# EAGLE schematic Keyboard (EAGLE 9.2.0)
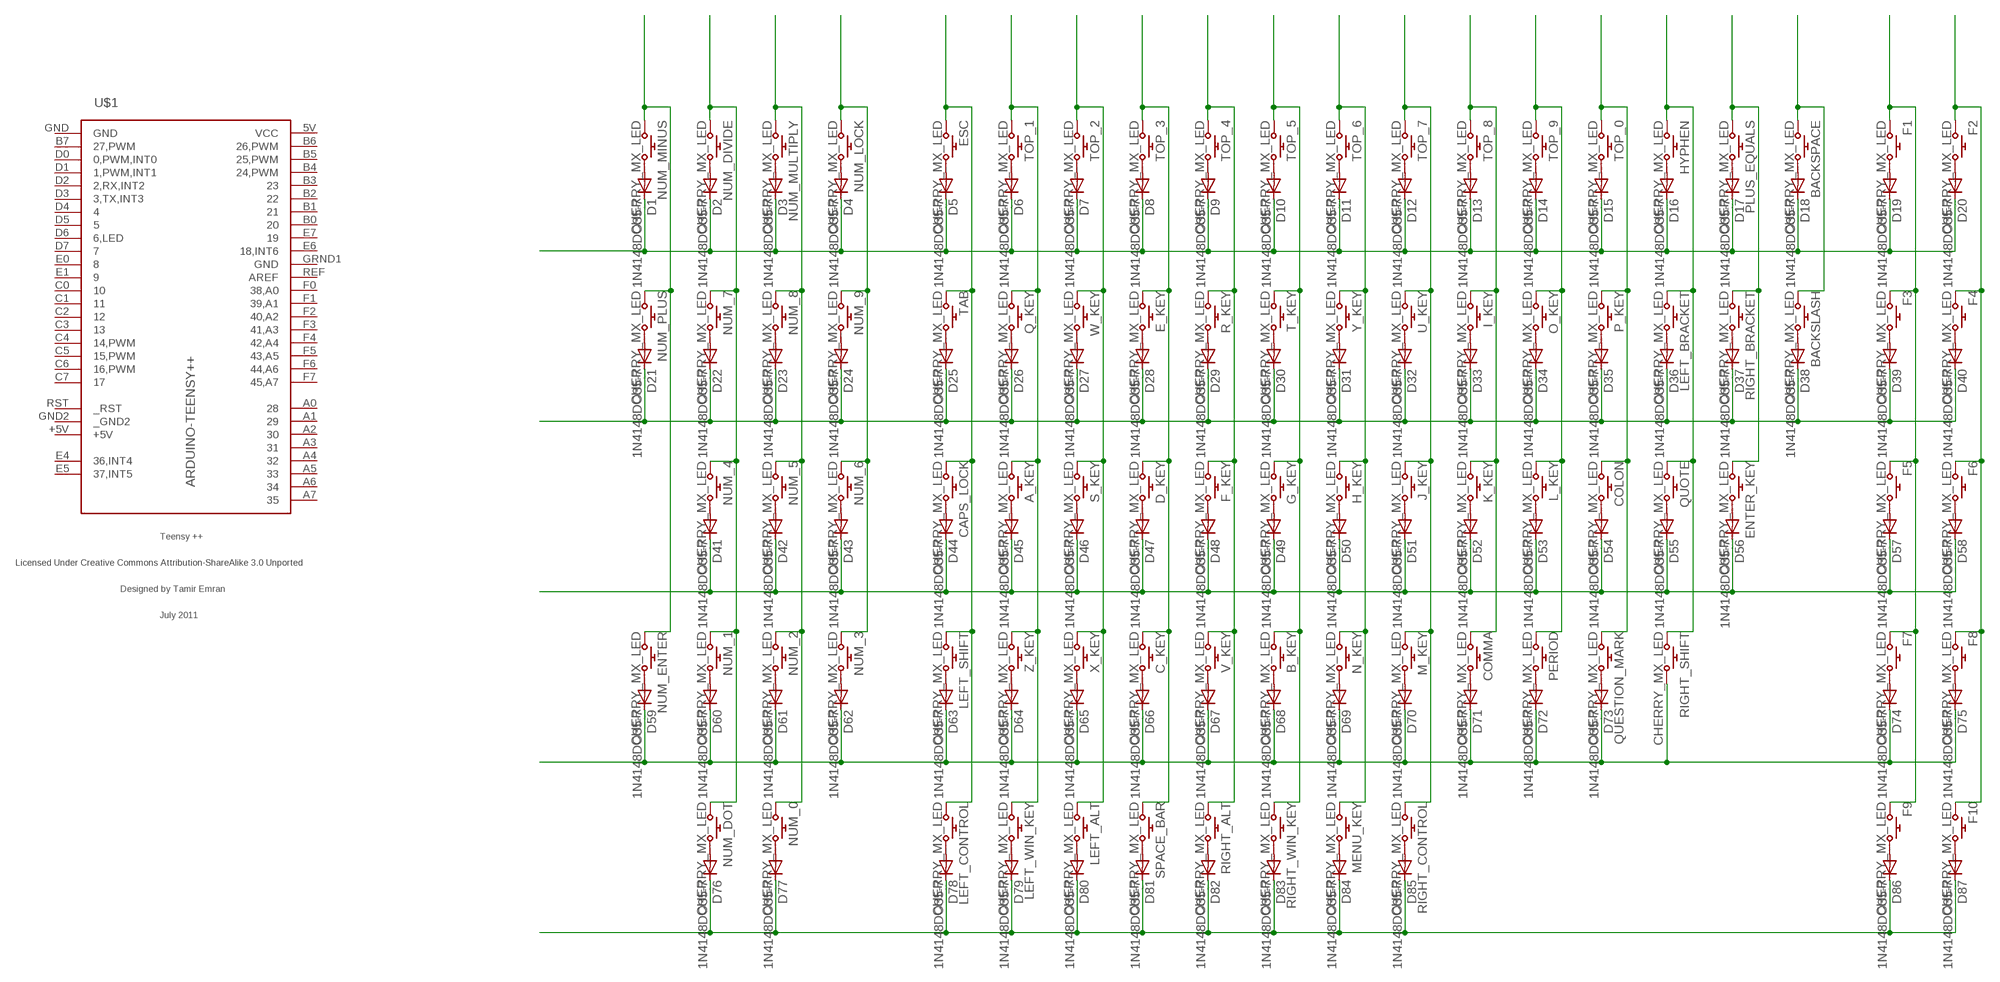
[diagram p0: schematic, sheet 1]

## Parts
A_KEY  CHERRY_MX_LED  [CHERRY_MX_LED]
B_KEY  CHERRY_MX_LED  [CHERRY_MX_LED]
BACKSLASH  CHERRY_MX_LED  [CHERRY_MX_LED]
BACKSPACE  CHERRY_MX_LED  [CHERRY_MX_LED]
C_KEY  CHERRY_MX_LED  [CHERRY_MX_LED]
CAPS_LOCK  CHERRY_MX_LED  [CHERRY_MX_LED]
COLON  CHERRY_MX_LED  [CHERRY_MX_LED]
COMMA  CHERRY_MX_LED  [CHERRY_MX_LED]
D1  1N4148DO35-7  [DO35-7]
D2  1N4148DO35-7  [DO35-7]
D3  1N4148DO35-7  [DO35-7]
D4  1N4148DO35-7  [DO35-7]
D5  1N4148DO35-7  [DO35-7]
D6  1N4148DO35-7  [DO35-7]
D7  1N4148DO35-7  [DO35-7]
D8  1N4148DO35-7  [DO35-7]
D9  1N4148DO35-7  [DO35-7]
D10  1N4148DO35-7  [DO35-7]
D11  1N4148DO35-7  [DO35-7]
D12  1N4148DO35-7  [DO35-7]
D13  1N4148DO35-7  [DO35-7]
D14  1N4148DO35-7  [DO35-7]
D15  1N4148DO35-7  [DO35-7]
D16  1N4148DO35-7  [DO35-7]
D17  1N4148DO35-7  [DO35-7]
D18  1N4148DO35-7  [DO35-7]
D19  1N4148DO35-7  [DO35-7]
D20  1N4148DO35-7  [DO35-7]
D21  1N4148DO35-7  [DO35-7]
D22  1N4148DO35-7  [DO35-7]
D23  1N4148DO35-7  [DO35-7]
D24  1N4148DO35-7  [DO35-7]
D25  1N4148DO35-7  [DO35-7]
D26  1N4148DO35-7  [DO35-7]
D27  1N4148DO35-7  [DO35-7]
D28  1N4148DO35-7  [DO35-7]
D29  1N4148DO35-7  [DO35-7]
D30  1N4148DO35-7  [DO35-7]
D31  1N4148DO35-7  [DO35-7]
D32  1N4148DO35-7  [DO35-7]
D33  1N4148DO35-7  [DO35-7]
D34  1N4148DO35-7  [DO35-7]
D35  1N4148DO35-7  [DO35-7]
D36  1N4148DO35-7  [DO35-7]
D37  1N4148DO35-7  [DO35-7]
D38  1N4148DO35-7  [DO35-7]
D39  1N4148DO35-7  [DO35-7]
D40  1N4148DO35-7  [DO35-7]
D41  1N4148DO35-7  [DO35-7]
D42  1N4148DO35-7  [DO35-7]
D43  1N4148DO35-7  [DO35-7]
D44  1N4148DO35-7  [DO35-7]
D45  1N4148DO35-7  [DO35-7]
D46  1N4148DO35-7  [DO35-7]
D47  1N4148DO35-7  [DO35-7]
D48  1N4148DO35-7  [DO35-7]
D49  1N4148DO35-7  [DO35-7]
D50  1N4148DO35-7  [DO35-7]
D51  1N4148DO35-7  [DO35-7]
D52  1N4148DO35-7  [DO35-7]
D53  1N4148DO35-7  [DO35-7]
D54  1N4148DO35-7  [DO35-7]
D55  1N4148DO35-7  [DO35-7]
D56  1N4148DO35-7  [DO35-7]
D57  1N4148DO35-7  [DO35-7]
D58  1N4148DO35-7  [DO35-7]
D59  1N4148DO35-7  [DO35-7]
D60  1N4148DO35-7  [DO35-7]
D61  1N4148DO35-7  [DO35-7]
D62  1N4148DO35-7  [DO35-7]
D63  1N4148DO35-7  [DO35-7]
D64  1N4148DO35-7  [DO35-7]
D65  1N4148DO35-7  [DO35-7]
D66  1N4148DO35-7  [DO35-7]
D67  1N4148DO35-7  [DO35-7]
D68  1N4148DO35-7  [DO35-7]
D69  1N4148DO35-7  [DO35-7]
D70  1N4148DO35-7  [DO35-7]
D71  1N4148DO35-7  [DO35-7]
D72  1N4148DO35-7  [DO35-7]
D73  1N4148DO35-7  [DO35-7]
D74  1N4148DO35-7  [DO35-7]
D75  1N4148DO35-7  [DO35-7]
D76  1N4148DO35-7  [DO35-7]
D77  1N4148DO35-7  [DO35-7]
D78  1N4148DO35-7  [DO35-7]
D79  1N4148DO35-7  [DO35-7]
D80  1N4148DO35-7  [DO35-7]
D81  1N4148DO35-7  [DO35-7]
D82  1N4148DO35-7  [DO35-7]
D83  1N4148DO35-7  [DO35-7]
D84  1N4148DO35-7  [DO35-7]
D85  1N4148DO35-7  [DO35-7]
D86  1N4148DO35-7  [DO35-7]
D87  1N4148DO35-7  [DO35-7]
D_KEY  CHERRY_MX_LED  [CHERRY_MX_LED]
E_KEY  CHERRY_MX_LED  [CHERRY_MX_LED]
ENTER_KEY  CHERRY_MX_LED  [CHERRY_MX_LED]
ESC  CHERRY_MX_LED  [CHERRY_MX_LED]
F1  CHERRY_MX_LED  [CHERRY_MX_LED]
F2  CHERRY_MX_LED  [CHERRY_MX_LED]
F3  CHERRY_MX_LED  [CHERRY_MX_LED]
F4  CHERRY_MX_LED  [CHERRY_MX_LED]
F5  CHERRY_MX_LED  [CHERRY_MX_LED]
F6  CHERRY_MX_LED  [CHERRY_MX_LED]
F7  CHERRY_MX_LED  [CHERRY_MX_LED]
F8  CHERRY_MX_LED  [CHERRY_MX_LED]
F9  CHERRY_MX_LED  [CHERRY_MX_LED]
F10  CHERRY_MX_LED  [CHERRY_MX_LED]
F_KEY  CHERRY_MX_LED  [CHERRY_MX_LED]
G_KEY  CHERRY_MX_LED  [CHERRY_MX_LED]
H_KEY  CHERRY_MX_LED  [CHERRY_MX_LED]
HYPHEN  CHERRY_MX_LED  [CHERRY_MX_LED]
I_KEY  CHERRY_MX_LED  [CHERRY_MX_LED]
J_KEY  CHERRY_MX_LED  [CHERRY_MX_LED]
K_KEY  CHERRY_MX_LED  [CHERRY_MX_LED]
L_KEY  CHERRY_MX_LED  [CHERRY_MX_LED]
LEFT_ALT  CHERRY_MX_LED  [CHERRY_MX_LED]
LEFT_BRACKET  CHERRY_MX_LED  [CHERRY_MX_LED]
LEFT_CONTROL  CHERRY_MX_LED  [CHERRY_MX_LED]
LEFT_SHIFT  CHERRY_MX_LED  [CHERRY_MX_LED]
LEFT_WIN_KEY  CHERRY_MX_LED  [CHERRY_MX_LED]
M_KEY  CHERRY_MX_LED  [CHERRY_MX_LED]
MENU_KEY  CHERRY_MX_LED  [CHERRY_MX_LED]
N_KEY  CHERRY_MX_LED  [CHERRY_MX_LED]
NUM_0  CHERRY_MX_LED  [CHERRY_MX_LED]
NUM_1  CHERRY_MX_LED  [CHERRY_MX_LED]
NUM_2  CHERRY_MX_LED  [CHERRY_MX_LED]
NUM_3  CHERRY_MX_LED  [CHERRY_MX_LED]
NUM_4  CHERRY_MX_LED  [CHERRY_MX_LED]
NUM_5  CHERRY_MX_LED  [CHERRY_MX_LED]
NUM_6  CHERRY_MX_LED  [CHERRY_MX_LED]
NUM_7  CHERRY_MX_LED  [CHERRY_MX_LED]
NUM_8  CHERRY_MX_LED  [CHERRY_MX_LED]
NUM_9  CHERRY_MX_LED  [CHERRY_MX_LED]
NUM_DIVIDE  CHERRY_MX_LED  [CHERRY_MX_LED]
NUM_DOT  CHERRY_MX_LED  [CHERRY_MX_LED]
NUM_ENTER  CHERRY_MX_LED  [CHERRY_MX_LED]
NUM_LOCK  CHERRY_MX_LED  [CHERRY_MX_LED]
NUM_MINUS  CHERRY_MX_LED  [CHERRY_MX_LED]
NUM_MULTIPLY  CHERRY_MX_LED  [CHERRY_MX_LED]
NUM_PLUS  CHERRY_MX_LED  [CHERRY_MX_LED]
O_KEY  CHERRY_MX_LED  [CHERRY_MX_LED]
P_KEY  CHERRY_MX_LED  [CHERRY_MX_LED]
PERIOD  CHERRY_MX_LED  [CHERRY_MX_LED]
PLUS_EQUALS  CHERRY_MX_LED  [CHERRY_MX_LED]
Q_KEY  CHERRY_MX_LED  [CHERRY_MX_LED]
QUESTION_MARK  CHERRY_MX_LED  [CHERRY_MX_LED]
QUOTE  CHERRY_MX_LED  [CHERRY_MX_LED]
R_KEY  CHERRY_MX_LED  [CHERRY_MX_LED]
RIGHT_ALT  CHERRY_MX_LED  [CHERRY_MX_LED]
RIGHT_BRACKET  CHERRY_MX_LED  [CHERRY_MX_LED]
RIGHT_CONTROL  CHERRY_MX_LED  [CHERRY_MX_LED]
RIGHT_SHIFT  CHERRY_MX_LED  [CHERRY_MX_LED]
RIGHT_WIN_KEY  CHERRY_MX_LED  [CHERRY_MX_LED]
S_KEY  CHERRY_MX_LED  [CHERRY_MX_LED]
SPACE_BAR  CHERRY_MX_LED  [CHERRY_MX_LED]
T_KEY  CHERRY_MX_LED  [CHERRY_MX_LED]
TAB  CHERRY_MX_LED  [CHERRY_MX_LED]
TOP_0  CHERRY_MX_LED  [CHERRY_MX_LED]
TOP_1  CHERRY_MX_LED  [CHERRY_MX_LED]
TOP_2  CHERRY_MX_LED  [CHERRY_MX_LED]
TOP_3  CHERRY_MX_LED  [CHERRY_MX_LED]
TOP_4  CHERRY_MX_LED  [CHERRY_MX_LED]
TOP_5  CHERRY_MX_LED  [CHERRY_MX_LED]
TOP_6  CHERRY_MX_LED  [CHERRY_MX_LED]
TOP_7  CHERRY_MX_LED  [CHERRY_MX_LED]
TOP_8  CHERRY_MX_LED  [CHERRY_MX_LED]
TOP_9  CHERRY_MX_LED  [CHERRY_MX_LED]
U$1  ARDUINO-TEENSY++  [TEENSY++]
U_KEY  CHERRY_MX_LED  [CHERRY_MX_LED]
V_KEY  CHERRY_MX_LED  [CHERRY_MX_LED]
W_KEY  CHERRY_MX_LED  [CHERRY_MX_LED]
X_KEY  CHERRY_MX_LED  [CHERRY_MX_LED]
Y_KEY  CHERRY_MX_LED  [CHERRY_MX_LED]
Z_KEY  CHERRY_MX_LED  [CHERRY_MX_LED]

## Nets
N$1: D1.A NUM_MINUS.S2
N$2: D2.A NUM_DIVIDE.S2
N$3: D3.A NUM_MULTIPLY.S2
N$4: D4.A NUM_LOCK.S2
N$5: D5.A ESC.S2
N$6: D6.A TOP_1.S2
N$7: D7.A TOP_2.S2
N$8: D8.A TOP_3.S2
N$9: D9.A TOP_4.S2
N$10: D10.A TOP_5.S2
N$11: D11.A TOP_6.S2
N$12: D12.A TOP_7.S2
N$13: D13.A TOP_8.S2
N$14: D14.A TOP_9.S2
N$15: D15.A TOP_0.S2
N$16: D16.A HYPHEN.S2
N$17: D17.A PLUS_EQUALS.S2
N$18: BACKSPACE.S2 D18.A
N$19: D19.A F1.S2
N$20: D20.A F2.S2
N$21: D21.A NUM_PLUS.S2
N$22: D22.A NUM_7.S2
N$23: D23.A NUM_8.S2
N$24: D24.A NUM_9.S2
N$25: D25.A TAB.S2
N$26: D26.A Q_KEY.S2
N$27: D27.A W_KEY.S2
N$28: D28.A E_KEY.S2
N$29: D29.A R_KEY.S2
N$30: D30.A T_KEY.S2
N$31: D31.A Y_KEY.S2
N$32: D32.A U_KEY.S2
N$33: D33.A I_KEY.S2
N$34: D34.A O_KEY.S2
N$35: D35.A P_KEY.S2
N$36: D36.A LEFT_BRACKET.S2
N$37: D37.A RIGHT_BRACKET.S2
N$38: BACKSLASH.S2 D38.A
N$39: D39.A F3.S2
N$40: D40.A F4.S2
N$41: D41.A NUM_4.S2
N$42: D42.A NUM_5.S2
N$43: D43.A NUM_6.S2
N$44: CAPS_LOCK.S2 D44.A
N$45: A_KEY.S2 D45.A
N$46: D46.A S_KEY.S2
N$47: D47.A D_KEY.S2
N$48: D48.A F_KEY.S2
N$49: D49.A G_KEY.S2
N$50: D50.A H_KEY.S2
N$51: D51.A J_KEY.S2
N$52: D52.A K_KEY.S2
N$53: D53.A L_KEY.S2
N$54: COLON.S2 D54.A
N$55: D55.A QUOTE.S2
N$56: D56.A ENTER_KEY.S2
N$57: D57.A F5.S2
N$58: D58.A F6.S2
N$59: D59.A NUM_ENTER.S2
N$60: D60.A NUM_1.S2
N$61: D61.A NUM_2.S2
N$62: D62.A NUM_3.S2
N$63: D63.A LEFT_SHIFT.S2
N$64: D64.A Z_KEY.S2
N$65: D65.A X_KEY.S2
N$66: C_KEY.S2 D66.A
N$67: D67.A V_KEY.S2
N$68: B_KEY.S2 D68.A
N$69: D69.A N_KEY.S2
N$70: D70.A M_KEY.S2
N$71: COMMA.S2 D71.A
N$72: D72.A PERIOD.S2
N$73: D73.A QUESTION_MARK.S2
N$74: D74.A F7.S2
N$75: D75.A F8.S2
N$76: D76.A NUM_DOT.S2
N$77: D77.A NUM_0.S2
N$78: D78.A LEFT_CONTROL.S2
N$79: D79.A LEFT_WIN_KEY.S2
N$80: D80.A LEFT_ALT.S2
N$81: D81.A SPACE_BAR.S2
N$82: D82.A RIGHT_ALT.S2
N$83: D83.A RIGHT_WIN_KEY.S2
N$84: D84.A MENU_KEY.S2
N$85: D85.A RIGHT_CONTROL.S2
N$86: D86.A F9.S2
N$87: D87.A F10.S2
N$88: D1.C D2.C D3.C D4.C D5.C D6.C D7.C D8.C D9.C D10.C D11.C D12.C D13.C D14.C D15.C D16.C D17.C D18.C D19.C D20.C
N$90: D21.C D22.C D23.C D24.C D25.C D26.C D27.C D28.C D29.C D30.C D31.C D32.C D33.C D34.C D35.C D36.C D37.C D38.C D39.C D40.C
N$91: D41.C D42.C D43.C D44.C D45.C D46.C D47.C D48.C D49.C D50.C D51.C D52.C D53.C D54.C D55.C D56.C D57.C D58.C
N$92: D59.C D60.C D61.C D62.C D63.C D64.C D65.C D66.C D67.C D68.C D69.C D70.C D71.C D72.C D73.C D74.C D75.C RIGHT_SHIFT.S2
N$93: D76.C D77.C D78.C D79.C D80.C D81.C D82.C D83.C D84.C D85.C D86.C D87.C
N$94: NUM_ENTER.S1 NUM_MINUS.S1 NUM_PLUS.S1
N$95: NUM_1.S1 NUM_4.S1 NUM_7.S1 NUM_DIVIDE.S1 NUM_DOT.S1
N$96: NUM_0.S1 NUM_2.S1 NUM_5.S1 NUM_8.S1 NUM_MULTIPLY.S1
N$97: NUM_3.S1 NUM_6.S1 NUM_9.S1 NUM_LOCK.S1
N$98: CAPS_LOCK.S1 ESC.S1 LEFT_CONTROL.S1 LEFT_SHIFT.S1 TAB.S1
N$99: A_KEY.S1 LEFT_WIN_KEY.S1 Q_KEY.S1 TOP_1.S1 Z_KEY.S1
N$100: LEFT_ALT.S1 S_KEY.S1 TOP_2.S1 W_KEY.S1 X_KEY.S1
N$101: C_KEY.S1 D_KEY.S1 E_KEY.S1 SPACE_BAR.S1 TOP_3.S1
N$102: F_KEY.S1 R_KEY.S1 RIGHT_ALT.S1 TOP_4.S1 V_KEY.S1
N$103: B_KEY.S1 G_KEY.S1 RIGHT_WIN_KEY.S1 T_KEY.S1 TOP_5.S1
N$104: H_KEY.S1 MENU_KEY.S1 N_KEY.S1 TOP_6.S1 Y_KEY.S1
N$105: J_KEY.S1 M_KEY.S1 RIGHT_CONTROL.S1 TOP_7.S1 U_KEY.S1
N$106: COMMA.S1 I_KEY.S1 K_KEY.S1 TOP_8.S1
N$107: L_KEY.S1 O_KEY.S1 PERIOD.S1 TOP_9.S1
N$108: COLON.S1 P_KEY.S1 QUESTION_MARK.S1 TOP_0.S1
N$109: HYPHEN.S1 LEFT_BRACKET.S1 QUOTE.S1 RIGHT_SHIFT.S1
N$110: ENTER_KEY.S1 PLUS_EQUALS.S1 RIGHT_BRACKET.S1
N$111: BACKSLASH.S1 BACKSPACE.S1
N$112: F1.S1 F3.S1 F5.S1 F7.S1 F9.S1
N$113: F2.S1 F4.S1 F6.S1 F8.S1 F10.S1
Unconnected: A_KEY.L1(A) A_KEY.L2(C) B_KEY.L1(A) B_KEY.L2(C) BACKSLASH.L1(A) BACKSLASH.L2(C) BACKSPACE.L1(A) BACKSPACE.L2(C) C_KEY.L1(A) C_KEY.L2(C) CAPS_LOCK.L1(A) CAPS_LOCK.L2(C) COLON.L1(A) COLON.L2(C) COMMA.L1(A) COMMA.L2(C) D_KEY.L1(A) D_KEY.L2(C) E_KEY.L1(A) E_KEY.L2(C) ENTER_KEY.L1(A) ENTER_KEY.L2(C) ESC.L1(A) ESC.L2(C) F1.L1(A) F1.L2(C) F2.L1(A) F2.L2(C) F3.L1(A) F3.L2(C) F4.L1(A) F4.L2(C) F5.L1(A) F5.L2(C) F6.L1(A) F6.L2(C) F7.L1(A) F7.L2(C) F8.L1(A) F8.L2(C) F9.L1(A) F9.L2(C) F10.L1(A) F10.L2(C) F_KEY.L1(A) F_KEY.L2(C) G_KEY.L1(A) G_KEY.L2(C) H_KEY.L1(A) H_KEY.L2(C) HYPHEN.L1(A) HYPHEN.L2(C) I_KEY.L1(A) I_KEY.L2(C) J_KEY.L1(A) J_KEY.L2(C) K_KEY.L1(A) K_KEY.L2(C) L_KEY.L1(A) L_KEY.L2(C) LEFT_ALT.L1(A) LEFT_ALT.L2(C) LEFT_BRACKET.L1(A) LEFT_BRACKET.L2(C) LEFT_CONTROL.L1(A) LEFT_CONTROL.L2(C) LEFT_SHIFT.L1(A) LEFT_SHIFT.L2(C) LEFT_WIN_KEY.L1(A) LEFT_WIN_KEY.L2(C) M_KEY.L1(A) M_KEY.L2(C) MENU_KEY.L1(A) MENU_KEY.L2(C) N_KEY.L1(A) N_KEY.L2(C) NUM_0.L1(A) NUM_0.L2(C) NUM_1.L1(A) NUM_1.L2(C) NUM_2.L1(A) NUM_2.L2(C) NUM_3.L1(A) NUM_3.L2(C) NUM_4.L1(A) NUM_4.L2(C) NUM_5.L1(A) NUM_5.L2(C) NUM_6.L1(A) NUM_6.L2(C) NUM_7.L1(A) NUM_7.L2(C) NUM_8.L1(A) NUM_8.L2(C) NUM_9.L1(A) NUM_9.L2(C) NUM_DIVIDE.L1(A) NUM_DIVIDE.L2(C) NUM_DOT.L1(A) NUM_DOT.L2(C) NUM_ENTER.L1(A) NUM_ENTER.L2(C) NUM_LOCK.L1(A) NUM_LOCK.L2(C) NUM_MINUS.L1(A) NUM_MINUS.L2(C) NUM_MULTIPLY.L1(A) NUM_MULTIPLY.L2(C) NUM_PLUS.L1(A) NUM_PLUS.L2(C) O_KEY.L1(A) O_KEY.L2(C) P_KEY.L1(A) P_KEY.L2(C) PERIOD.L1(A) PERIOD.L2(C) PLUS_EQUALS.L1(A) PLUS_EQUALS.L2(C) Q_KEY.L1(A) Q_KEY.L2(C) QUESTION_MARK.L1(A) QUESTION_MARK.L2(C) QUOTE.L1(A) QUOTE.L2(C) R_KEY.L1(A) R_KEY.L2(C) RIGHT_ALT.L1(A) RIGHT_ALT.L2(C) RIGHT_BRACKET.L1(A) RIGHT_BRACKET.L2(C) RIGHT_CONTROL.L1(A) RIGHT_CONTROL.L2(C) RIGHT_SHIFT.L1(A) RIGHT_SHIFT.L2(C) RIGHT_WIN_KEY.L1(A) RIGHT_WIN_KEY.L2(C) S_KEY.L1(A) S_KEY.L2(C) SPACE_BAR.L1(A) SPACE_BAR.L2(C) T_KEY.L1(A) T_KEY.L2(C) TAB.L1(A) TAB.L2(C) TOP_0.L1(A) TOP_0.L2(C) TOP_1.L1(A) TOP_1.L2(C) TOP_2.L1(A) TOP_2.L2(C) TOP_3.L1(A) TOP_3.L2(C) TOP_4.L1(A) TOP_4.L2(C) TOP_5.L1(A) TOP_5.L2(C) TOP_6.L1(A) TOP_6.L2(C) TOP_7.L1(A) TOP_7.L2(C) TOP_8.L1(A) TOP_8.L2(C) TOP_9.L1(A) TOP_9.L2(C) U$1.A0 U$1.A1 U$1.A2 U$1.A3 U$1.A4 U$1.A5 U$1.A6 U$1.A7 U$1.B0 U$1.B1 U$1.B2 U$1.B3 U$1.B4(24,PWM) U$1.B5(25,PWM) U$1.B6(26,PWM) U$1.B7(27,PWM) U$1.C0 U$1.C1 U$1.C2 U$1.C3 U$1.C4(14,PWM) U$1.C5(15,PWM) U$1.C6(16,PWM) U$1.C7 U$1.D0(0,PWM,INT0) U$1.D1(1,PWM,INT1) U$1.D2(2,RX,INT2) U$1.D3(3,TX,INT3) U$1.D4 U$1.D5 U$1.D6(6,LED) U$1.D7 U$1.E0 U$1.E1 U$1.E4(36,INT4) U$1.E5(37,INT5) U$1.E6(18,INT6) U$1.E7 U$1.F0(38,A0) U$1.F1(39,A1) U$1.F2(40,A2) U$1.F3(41,A3) U$1.F4(42,A4) U$1.F5(43,A5) U$1.F6(44,A6) U$1.F7(45,A7) U$1.REF(AREF) U$1.RST(_RST) U_KEY.L1(A) U_KEY.L2(C) V_KEY.L1(A) V_KEY.L2(C) W_KEY.L1(A) W_KEY.L2(C) X_KEY.L1(A) X_KEY.L2(C) Y_KEY.L1(A) Y_KEY.L2(C) Z_KEY.L1(A) Z_KEY.L2(C)

## Power pins joined to a net without a drawn wire
+5V: U$1.+5V
_GND2: U$1.GND2(_GND2)
GND: U$1.GND U$1.GRND1(GND)
VCC: U$1.5V(VCC)

## Library data of the parts
A_KEY B_KEY BACKSLASH BACKSPACE C_KEY CAPS_LOCK COLON COMMA D_KEY E_KEY ENTER_KEY ESC F1-F10 F_KEY G_KEY H_KEY HYPHEN I_KEY J_KEY K_KEY L_KEY LEFT_ALT LEFT_BRACKET LEFT_CONTROL LEFT_SHIFT LEFT_WIN_KEY M_KEY MENU_KEY N_KEY NUM_0 NUM_1-NUM_9 NUM_DIVIDE NUM_DOT NUM_ENTER NUM_LOCK NUM_MINUS NUM_MULTIPLY NUM_PLUS O_KEY P_KEY PERIOD PLUS_EQUALS Q_KEY QUESTION_MARK QUOTE R_KEY RIGHT_ALT RIGHT_BRACKET RIGHT_CONTROL RIGHT_SHIFT RIGHT_WIN_KEY S_KEY SPACE_BAR T_KEY TAB TOP_0 TOP_1-TOP_9 U_KEY V_KEY W_KEY X_KEY Y_KEY Z_KEY = cherry:CHERRY_MX_LED: Cherry MX with LED; FARNELL: 2292961; MOUSER: 540_MX1A_11NW
D1-D87 = diode:1N4148: DIODE high speed (Philips)
U$1 = teensypp:ARDUINO-TEENSY++: Teensy ++ Original Design by Mark Gross Modified Design by Tamir Emran Licensed Under Creative Commons Attribution-ShareAlike 3.0 Unported (CC BY-SA 3.0)